# EAGLE design miniosc (EAGLE 7.5.0)
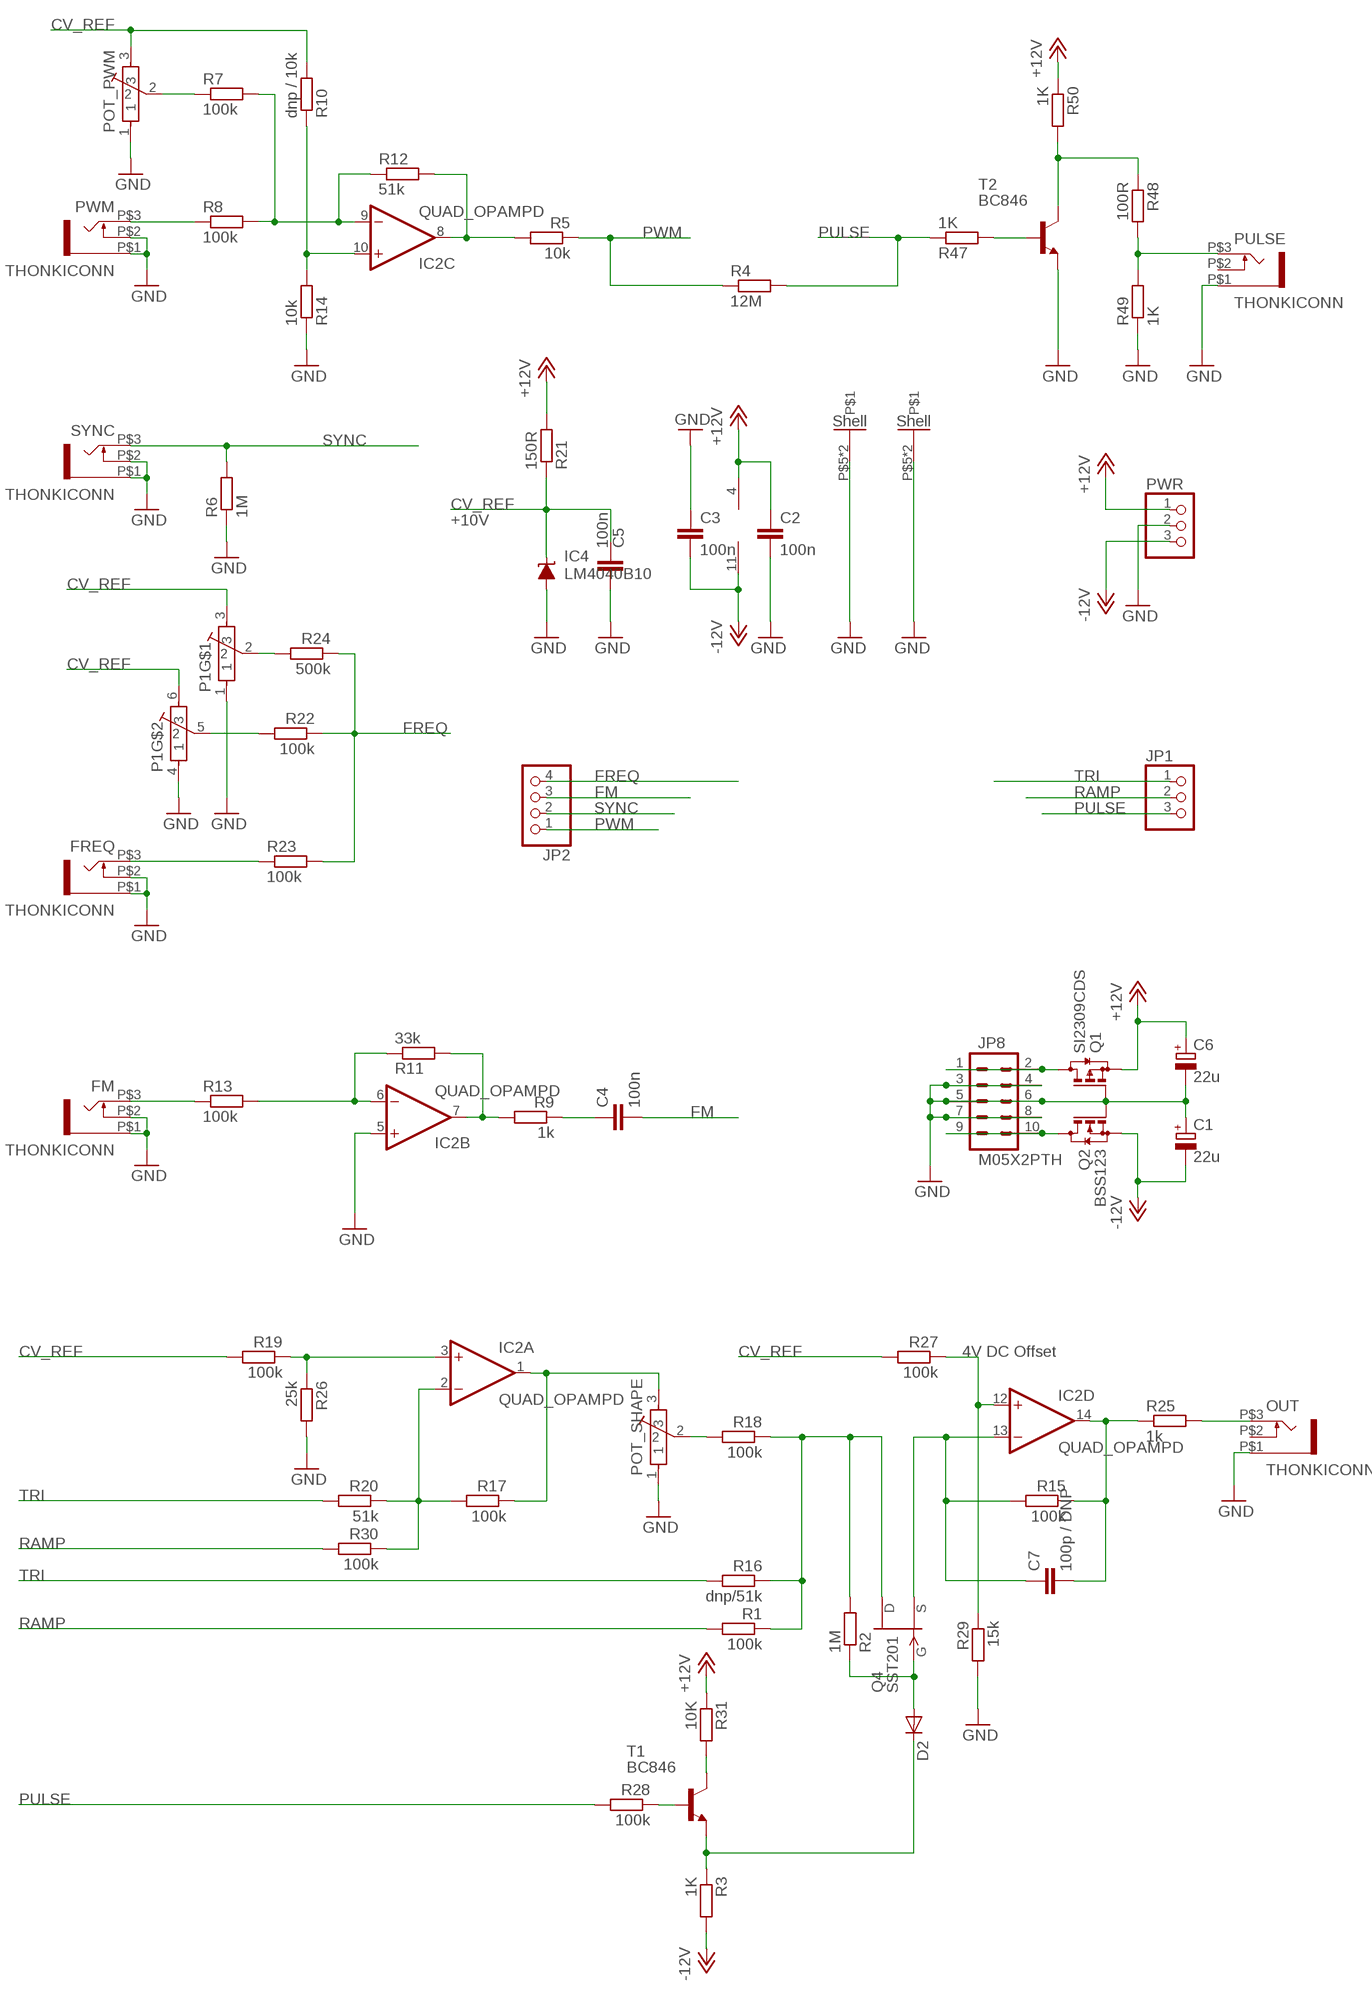
[diagram p0: schematic, sheet 1]

## Parts
C1  22u  CPOL-EU153CLV-0505  [CPOL-5]
C2  100n  C-EUC0603  [C0603]
C3  100n  C-EUC0603  [C0603]
C4  100n  C-EUC0603  [C0603]
C5  100n  C-EUC0603  [C0603]
C6  22u  CPOL-EU153CLV-0505  [CPOL-5]
C7  100p / DNP  C-EUC0603  [C0603]
D2  DIODE  [DIODE-0805]
FM  THONKICONN  [THONKICONN]
FREQ  THONKICONN  [THONKICONN]
IC2  QUAD_OPAMPD  [SO14]
IC4  LM4040B10  LM4041C12DBZ  [DBZ_R-PDSO-G3]
JP1  PINHD-1X3  [1X03]
JP2  PINHD-1X4  [1X04]
JP8  M05X2PTH  [AVR_ICSP]
OUT  THONKICONN  [THONKICONN]
P1  POT-BOURNS-PTD902  [POT-BOURNS-PTD902]
POT_PWM  POT-ALPS-RK09L1140  [POT-ALPS-RK09L1140]
POT_SHAPE  POT-ALPS-RK09L1140  [POT-ALPS-RK09L1140]
PULSE  THONKICONN  [THONKICONN]
PWM  THONKICONN  [THONKICONN]
PWR  PINHD-1X3  [1X03]
Q1  SI2309CDS  BSS84  [SOT23]
Q2  BSS123  [SOT23]
Q4  SST201  [SOT23]
R1  100k  R-EU_0603  [0603]
R2  1M  R-EU_0603  [0603]
R3  1K  R-EU_0603  [0603]
R4  12M  R-EU_0603  [0603]
R5  10k  R-EU_0603  [0603]
R6  1M  R-EU_0603  [0603]
R7  100k  R-EU_0603  [0603]
R8  100k  R-EU_0603  [0603]
R9  1k  R-EU_0603  [0603]
R10  dnp / 10k  R-EU_0603  [0603]
R11  33k  R-EU_0603  [0603]
R12  51k  R-EU_0603  [0603]
R13  100k  R-EU_0603  [0603]
R14  10k  R-EU_0603  [0603]
R15  100k  R-EU_0603  [0603]
R16  dnp/51k  R-EU_0603  [0603]
R17  100k  R-EU_0603  [0603]
R18  100k  R-EU_0603  [0603]
R19  100k  R-EU_0603  [0603]
R20  51k  R-EU_0603  [0603]
R21  150R  R-EU_0603  [0603]
R22  100k  R-EU_0603  [0603]
R23  100k  R-EU_0603  [0603]
R24  500k  R-EU_0603  [0603]
R25  1k  R-EU_0603  [0603]
R26  25k  R-EU_0603  [0603]
R27  100k  R-EU_0603  [0603]
R28  100k  R-EU_0603  [0603]
R29  15k  R-EU_0603  [0603]
R30  100k  R-EU_0603  [0603]
R31  10K  R-EU_0603  [0603]
R47  1K  R-EU_0603  [0603]
R48  100R  R-EU_0603  [0603]
R49  1K  R-EU_0603  [0603]
R50  1K  R-EU_0603  [0603]
SYNC  THONKICONN  [THONKICONN]
T1  BC846  [SOT23]
T2  BC846  [SOT23]

## Nets
+12V: C2.1 C6.+ IC2.4(P:V+) PWR.1 Q1.2(S) R21.2 R31.1 R50.1
-12V: C1.- C3.2 IC2.11(P:V-) PWR.3 Q2.2(S) R3.2
CV_REF: C5.1 IC4.1(C) P1.3 P1.6 POT_PWM.3 R10.2 R19.2 R21.1 R27.2
FM: C4.2 JP2.3
FREQ: JP2.4 R22.1 R23.2 R24.1
GND: C1.+ C2.2 C3.1 C5.2 C6.- FM.P$1 FM.P$2 FREQ.P$1 FREQ.P$2 IC2.5(B:+IN) IC4.2(A) JP8.3 JP8.4 JP8.5 JP8.6 JP8.7 JP8.8 OUT.P$1 P1.1 P1.4 POT_PWM.1 POT_PWM.P$5 POT_PWM.P$6 POT_SHAPE.1 POT_SHAPE.P$5 POT_SHAPE.P$6 PULSE.P$1 PWM.P$1 PWM.P$2 PWR.2 Q1.1(G) Q2.1(G) R6.1 R14.1 R26.2 R29.2 R49.1 SYNC.P$1 SYNC.P$2 T2.2(E)
N$1: R31.2 T1.3(C)
N$2: PWM.P$3 R8.1
N$3: FREQ.P$3 R23.1
N$4: C7.1 IC2.13(D:-IN) Q4.2(S) R15.2
N$6: IC2.9(C:-IN) R7.2 R8.2 R12.1
N$7: IC2.10(C:+IN) R10.1 R14.2
N$8: JP8.9 JP8.10 Q2.3(D)
N$9: P1.2 R24.2
N$10: PULSE.P$3 R48.2 R49.2
N$11: IC2.1(A:OUT) POT_SHAPE.3 R17.1
N$12: JP8.1 JP8.2 Q1.3(D)
N$14: P1.5 R22.2
N$15: IC2.2(A:-IN) R17.2 R20.1 R30.1
N$16: C7.2 IC2.14(D:OUT) R15.1 R25.1
N$17: IC2.3(A:+IN) R19.1 R26.1
N$18: IC2.12(D:+IN) R27.1 R29.1
N$19: FM.P$3 R13.1
N$20: IC2.6(B:-IN) R11.1 R13.2
N$21: OUT.P$3 R25.2
N$22: IC2.7(B:OUT) R9.2 R11.2
N$23: C4.1 R9.1
N$25: Q4.1(D) R1.1 R2.2 R16.1 R18.1
N$26: D2.C R3.1 T1.2(E)
N$27: POT_PWM.2 R7.1
N$28: IC2.8(C:OUT) R5.2 R12.2
N$29: R28.1 T1.1(B)
N$30: POT_SHAPE.2 R18.2
N$32: D2.A Q4.3(G) R2.1
N$62: R47.2 T2.1(B)
N$63: R48.1 R50.2 T2.3(C)
PULSE: JP1.3 R4.2 R28.2 R47.1
PWM: JP2.1 R4.1 R5.1
RAMP: JP1.2 R1.2 R30.2
SYNC: JP2.2 R6.2 SYNC.P$3
TRI: JP1.1 R16.2 R20.2
Unconnected: OUT.P$2 PULSE.P$2

## Notes on the sheet
- +10V
- 4V DC Offset

## Library data of the parts
C1 C6 = Rebel:CPOL-EU: POLARIZED CAPACITOR, European symbol
C2-C5 C7 = Rebel:C-EU: CAPACITOR, European symbol
D2 = Rebel:DIODE: Diode These are standard reverse protection diodes and small signal diodes. SMA package can handle up to about 1A. SOD-323 can handle about 200mA. Watch the SOD-323 package when ordering, there are some mfgs out there that are 5-pin packages.
FM FREQ OUT PULSE PWM SYNC = Rebel:THONKICONN
IC2 = adafruit:QUAD_OPAMP: OP AMP Standard quad package
IC4 = texas:LM4041: PRECISION MICROPOWER SHUNT VOLTAGE REFERENCE Source: http://focus.ti.com/lit/ds/slcs146e/slcs146e.pdf; MF: TEXAS INSTRUMENT CONNECTORS; MPN: LM4041C12QDBZT; OC_FARNELL: 1771733; OC_NEWARK: 43K3376
JP1 PWR = pinhead:PINHD-1X3: PIN HEADER
JP2 = pinhead:PINHD-1X4: PIN HEADER
JP8 = SparkFun:M05X2: Header 5x2 Standard 10-pin dual row 0.1" header. Commonly used with AVR-ISP. Use with Spark Fun Electronics SKU: PRT-00778
P1 = Rebel:POT-BOURNS-PTD902
POT_PWM POT_SHAPE = Rebel:POT-ALPS-RK09L
Q1 = transistor-small-signal:BSS84: P-CHANNEL MOS FET; OC_FARNELL: 1779264
Q2 = transistor-small-signal:BSS123: N-CHANNEL MOS FET; OC_FARNELL: 1843725
Q4 = transistor-fet:?20*: TEMIC / Siliconix N-Channel JFET Source: JFET-J201_Siliconix_data.pdf
R1-R31 R47-R50 = Rebel:R-EU_: RESISTOR, European symbol
T1 T2 = transistor:BC846: NPN TRANSISTOR

## Module VCO
Ports: FREQ_IN(io) FM_IN(io) SYNC_IN(io) PWM_IN(io) TRI_OUT(io) RAMP_OUT(io) PULSE_OUT(io) -12V(pwr) +12V(pwr) GND(pwr)
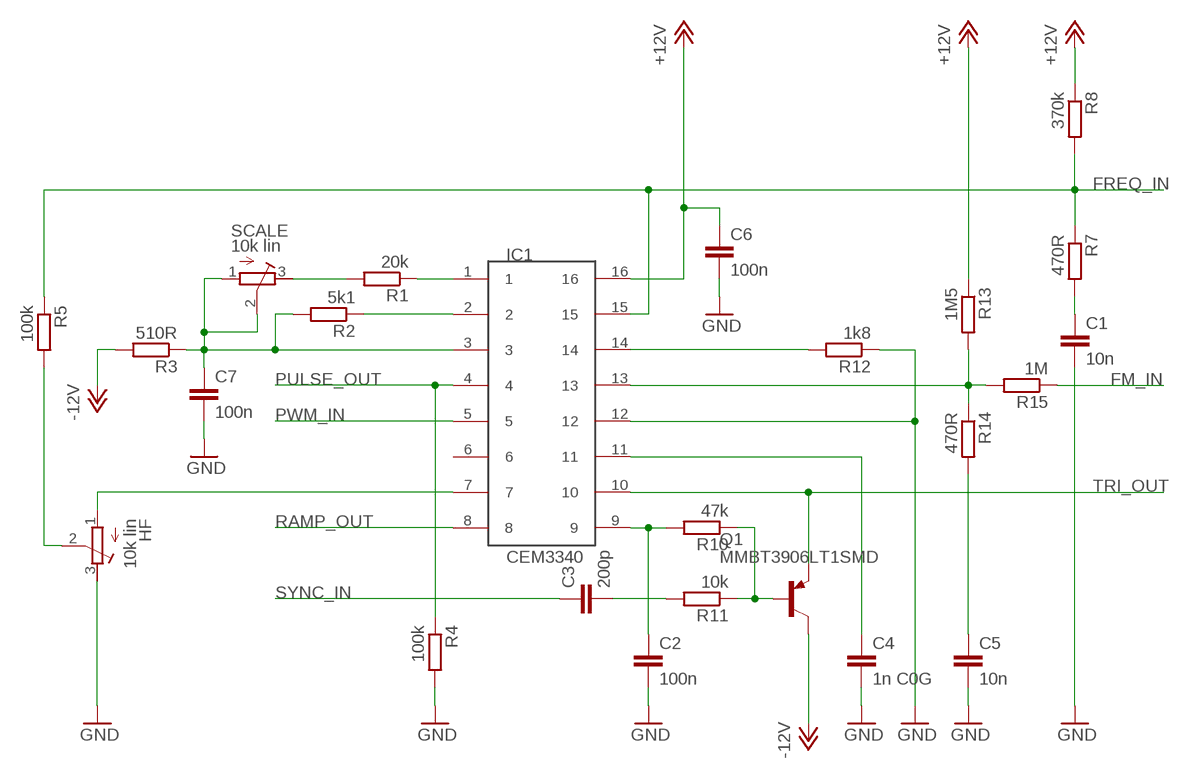
[diagram p1: schematic, module VCO, sheet 1]

### Parts
C1  10n  C-EUC0603  [C0603]
C2  100n  C-EUC0603  [C0603]
C3  200p  C-EUC0603  [C0603]
C4  1n C0G  C-EUC0603  [C0603]
C5  10n  C-EUC0603  [C0603]
C6  100n  C-EUC0603  [C0603]
C7  100n  C-EUC0603  [C0603]
HF  10k lin  R-TRIMM64W  [RTRIM64W]
IC1  CEM3340  [SOIC16N]
Q1  MMBT3906LT1SMD  [SOT23-BEC]
R1  20k  R-EU_0603  [0603]
R2  5k1  R-EU_0603  [0603]
R3  510R  R-EU_0603  [0603]
R4  100k  R-EU_0603  [0603]
R5  100k  R-EU_0603  [0603]
R7  470R  R-EU_0603  [0603]
R8  370k  R-EU_0603  [0603]
R10  47k  R-EU_0603  [0603]
R11  10k  R-EU_0603  [0603]
R12  1k8  R-EU_0603  [0603]
R13  1M5  R-EU_0603  [0603]
R14  470R  R-EU_0603  [0603]
R15  1M  R-EU_0603  [0603]
SCALE  10k lin  R-TRIMM64W  [RTRIM64W]

### Nets
+12V: C6.1 IC1.16 R8.1 R13.1
-12V: Q1.C R3.2
FM_IN: R15.1
FREQ_IN: IC1.15 R5.1 R7.1 R8.2
GND: C1.2 C2.2 C4.2 C5.2 C6.2 C7.2 HF.3(E) IC1.12 R4.2 R12.1
N$1: IC1.1 R1.1
N$2: R1.2 SCALE.3(E)
N$3: HF.1(A) IC1.7
N$4: IC1.2 R2.1
N$5: C7.1 IC1.3 R2.2 R3.1 SCALE.1(A) SCALE.2(S)
N$6: HF.2(S) R5.2
N$9: C1.1 R7.2
N$11: C2.1 IC1.9 R10.2
N$12: Q1.B R10.1 R11.1
N$13: C3.2 R11.2
N$14: C4.1 IC1.11
N$16: IC1.14 R12.2
N$17: IC1.13 R13.2 R14.1 R15.2
N$18: C5.1 R14.2
PULSE_OUT: IC1.4 R4.1
PWM_IN: IC1.5
RAMP_OUT: IC1.8
SYNC_IN: C3.1
TRI_OUT: IC1.10 Q1.E
Unconnected: IC1.6

### Library data of the parts
C1-C7 = Rebel:C-EU: CAPACITOR, European symbol
HF SCALE = resistor:R-TRIMM: Trimm resistor
IC1 = Rebel:CEM3340: CEM3340 VCO
Q1 = transistor-pnp:MMBT3906*: PNP Transistror
R1-R5 R7 R8 R10-R15 = Rebel:R-EU_: RESISTOR, European symbol

## Board
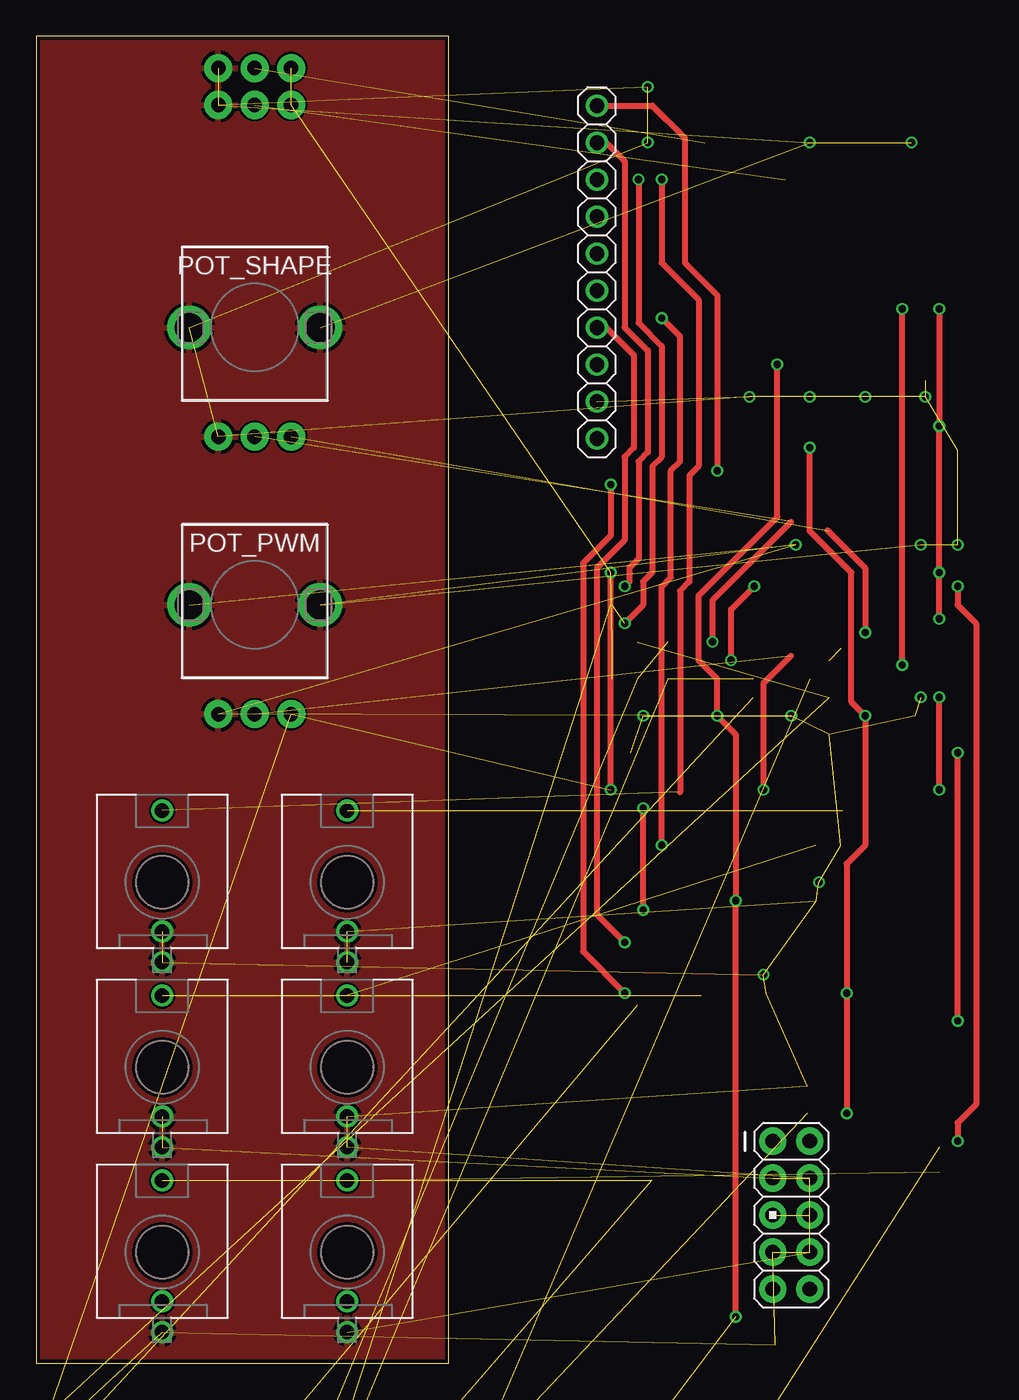
[diagram p2: board, top side]
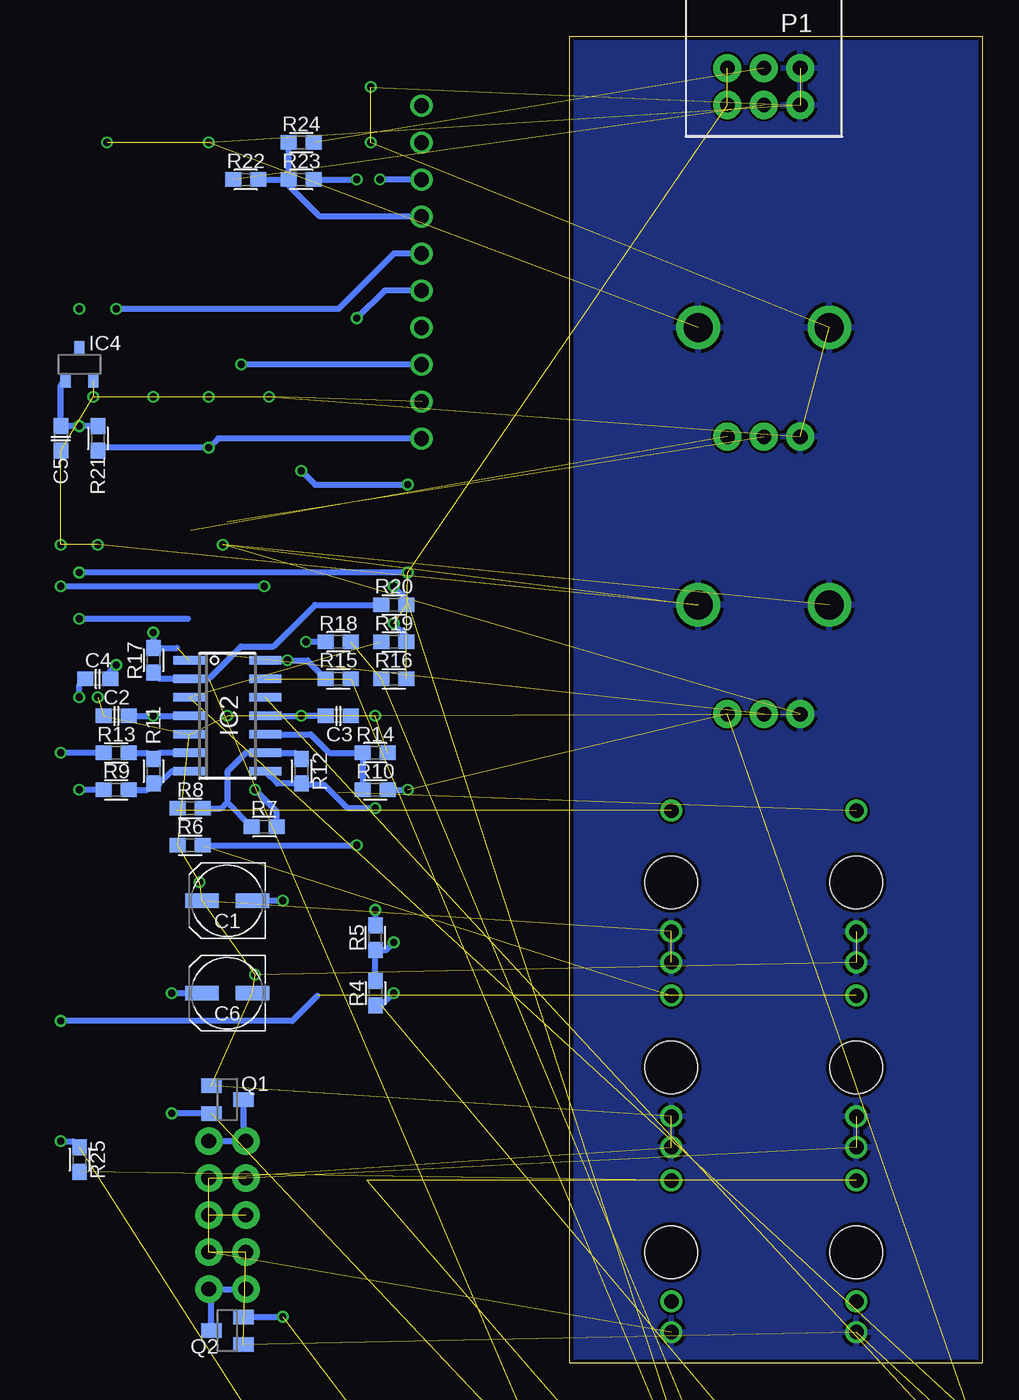
[diagram p3: board, bottom side, seen from below]

Size 28.3 x 91.11 mm. Coordinates in mm from the lower left corner, seen from the top.
Outline: 0,0 28.3,0 28.3,91.11 0,91.11 0,0
Copper layers (1*16): Top 0.035mm / dielectric 1.5mm / Bottom 0.035mm
Design rules "SeeedStudio_2layer_DRU_no_angle_20140221": minimum track width 6mil, minimum drill 12mil, track to track 6mil, track to pad 6mil, pad to pad 6mil, via to via 6mil, smd to smd 0mil, copper to edge 10mil, drill to drill 10mil, minimum pad ring 10mil, minimum via ring 6mil, stop-mask expansion 2mil, vias tented up to drill 100mil, thermal gap 10mil

### Footprints (pad centres in the part's own frame; a part is rotated, then mirrored left to right if it is on the bottom)
CPOL-5 = smd 2.3 x 1: + 1.725,0; - -1.725,0
C0603 = smd 1.1 x 1: 1 -0.85,0; 2 0.85,0
DIODE-0805 = smd 1.1 x 1.4: A -1,0; C 1,0
THONKICONN = drill 1: P$1 0,-5.5; P$2 0,-3.38; P$3 0,4.92 | hole 3.6: 0,0
SO14 = smd 0.6 x 2.2: 1 -3.81,-2.6; 2 -2.54,-2.6; 3 -1.27,-2.6; 4 0,-2.6; 5 1.27,-2.6; 6 2.54,-2.6; 7 3.81,-2.6; 8 3.81,2.6; 9 2.54,2.6; 10 1.27,2.6; 11 0,2.6; 12 -1.27,2.6; 13 -2.54,2.6; 14 -3.81,2.6
DBZ_R-PDSO-G3 = smd 0.7 x 1: 1 -0.95,-1.1; 2 0.95,-1.1; 3 0,1.1
1X03 = drill 1.016: 1 -2.54,0; 2 0,0; 3 2.54,0
1X04 = drill 1.016: 1 -3.81,0; 2 -1.27,0; 3 1.27,0; 4 3.81,0
AVR_ICSP = drill 1.016 pad 1.88: 1 -1.27,5.08; 2 1.27,5.08; 3 -1.27,2.54; 4 1.27,2.54; 5 -1.27,0; 6 1.27,0; 7 -1.27,-2.54; 8 1.27,-2.54; 9 -1.27,-5.08; 10 1.27,-5.08
POT-BOURNS-PTD902 = drill 1 pad 1.93: 1 -2.5,-0.036; 2 0,-0.036; 3 2.5,-0.036; 4 -2.5,2.5; 5 0,2.5; 6 2.5,2.5
POT-ALPS-RK09L1140 = drill 1 pad 1.93: 1 -2.5,-7.5; 2 0,-7.5; 3 2.5,-7.5 | drill 2: P$5 -4.5,0; P$6 4.5,0
SOT23 = smd 1 x 1.4: 1 -0.95,-1.1; 2 0.95,-1.1; 3 0,1.1
0603 = smd 1.1 x 1: 1 -0.85,0; 2 0.85,0

### Placement (x,y rotation side)
C1  51.82,31.75 180 bottom  (outside the outline)
C2  59.44,44.45 180 bottom  (outside the outline)
C3  44.2,44.45 180 bottom  (outside the outline)
C4  60.71,46.99 0 bottom  (outside the outline)
C5  63.25,63.5 270 bottom  (outside the outline)
C6  51.82,25.4 180 bottom  (outside the outline)
C7  -11.68,-99.06 0 top  (outside the outline)
D2  -11.68,-87.63 0 top  (outside the outline)
FM  8.64,20.32 0 top
FREQ  8.64,33.02 0 top
IC2  51.82,44.45 270 bottom  (outside the outline)
IC4  61.98,68.58 0 bottom  (outside the outline)
JP1  38.48,83.82 90 top  (outside the outline)
JP2  38.48,74.93 90 top  (outside the outline)
JP8  51.82,10.16 0 top  (outside the outline)
OUT  21.34,7.62 0 top
P1  14.99,88.9 180 bottom
POT_PWM  14.99,52.07 0 top
POT_SHAPE  14.99,71.12 0 top
PULSE  8.64,7.62 0 top
PWM  21.34,33.02 0 top
PWR  38.48,66.04 90 top  (outside the outline)
Q1  51.82,18.1 270 bottom  (outside the outline)
Q2  51.82,2.22 90 bottom  (outside the outline)
Q4  -11.68,-81.28 0 top  (outside the outline)
R1  -11.68,-102.87 0 top  (outside the outline)
R2  -11.68,-95.25 0 top  (outside the outline)
R3  -12.95,-76.2 0 top  (outside the outline)
R4  41.66,25.4 270 bottom  (outside the outline)
R5  41.66,29.21 90 bottom  (outside the outline)
R6  54.36,35.56 0 bottom  (outside the outline)
R7  49.28,36.83 180 bottom  (outside the outline)
R8  54.36,38.1 0 bottom  (outside the outline)
R9  59.44,39.37 0 bottom  (outside the outline)
R10  41.66,39.37 0 bottom  (outside the outline)
R11  56.9,40.64 270 bottom  (outside the outline)
R12  46.74,40.64 270 bottom  (outside the outline)
R13  59.44,41.91 0 bottom  (outside the outline)
R14  41.66,41.91 180 bottom  (outside the outline)
R15  44.2,46.99 0 bottom  (outside the outline)
R16  40.39,46.99 0 bottom  (outside the outline)
R17  56.9,48.26 270 bottom  (outside the outline)
R18  44.2,49.53 180 bottom  (outside the outline)
R19  40.39,49.53 0 bottom  (outside the outline)
R20  40.39,52.07 0 bottom  (outside the outline)
R21  60.71,63.5 270 bottom  (outside the outline)
R22  50.55,81.28 180 bottom  (outside the outline)
R23  46.74,81.28 180 bottom  (outside the outline)
R24  46.74,83.82 0 bottom  (outside the outline)
R25  61.98,13.97 270 bottom  (outside the outline)
R26  -2.79,-7.62 0 top  (outside the outline)
R27  -2.79,-11.43 0 top  (outside the outline)
R28  -2.79,-26.67 0 top  (outside the outline)
R29  -2.79,-30.48 0 top  (outside the outline)
R30  -11.68,-106.68 0 top  (outside the outline)
R31  -11.68,-110.49 0 top  (outside the outline)
R47  -12.95,-45.72 0 top  (outside the outline)
R48  -9.14,-45.72 0 top  (outside the outline)
R49  -12.95,-49.53 0 top  (outside the outline)
R50  -9.14,-49.53 0 top  (outside the outline)
SYNC  21.34,20.32 0 top
T1  -11.68,-66.04 0 top  (outside the outline)
T2  -11.68,-39.37 0 top  (outside the outline)

### Tracks (layer width: path | path; a pad name or v marks a point on that pad's centre or on a via)
+12V  (via drill 0.5)  (2 unrouted)
  Top 0.406: v55.63,17.14 v55.63,25.4 55.63,34.29 56.9,35.56 v56.9,44.45 55.94,45.4 55.94,54.29 53.09,57.15 v53.09,62.87
  Bottom 0.406: IC2.4 v56.9,44.45 C2.1 | Q1.2 v55.62,17.15 v55.63,17.14 | C6.+ v55.63,25.4 | R21.2 60.49,62.87 v53.09,62.87 52.45,63.5 PWR.1
-12V  (via drill 0.5)  (1 unrouted)
  Top 0.406: v48.01,3.17 v48.01,31.75 48.01,43.18 v46.74,44.45 46.74,46.99 45.47,48.26 45.47,52.7 50.86,58.1 v50.86,68.58
  Bottom 0.406: IC2.11 v46.74,44.45 C3.2 | Q2.2 49.28,3.17 v48.01,3.17 | PWR.3 v50.86,68.58 | v48.01,31.75 C1.-
CV_REF  (via drill 0.5)  (5 unrouted)
  Top 0.406: v61.98,51.12 v61.98,54.29 v61.98,64.35 v61.98,72.39 | v39.43,39.37 v39.43,54.29
  Bottom 0.406: IC4.1 63.25,67.16 C5.1 v61.98,64.35 R21.1 | v61.98,51.12 54.51,51.12 | R10.2 v39.43,39.37 | v39.43,54.29 v61.98,54.29
FM  (via drill 0.5)
  Top 0.406: v59.44,47.94 v59.44,72.39
  Bottom 0.406: C4.2 59.86,47.52 v59.44,47.94 | JP2.3 40.39,76.2 44.2,72.39 v59.44,72.39
FREQ
  Bottom 0.406: R22.1 R23.2 | JP2.4 45.47,78.74 47.59,80.86 R23.2 | R23.2 R24.1
GND  (via drill 0.5)  (55 unrouted)
  other vias: 41.97,83.82 41.97,87.63 53.09,83.82 51.82,44.45 60.71,45.72 41.66,44.45 53.72,33.02 49.91,26.67 52.13,56.2 60.71,56.2 63.25,56.2 48.96,66.36 53.09,66.36 56.9,66.36 61.02,66.36 60.07,83.82
  pour Bottom: -4.06,102.87 -4.06,-3.81 31.5,-3.81 31.5,102.87
  pour Top: -5.33,102.87 -5.33,-3.81 32.77,-3.81 32.77,102.87
N$1  (1 unrouted)
N$2  (1 unrouted)
  Bottom 0.406: 55.37,37.94 R8.1
N$3  (via drill 0.5)  (1 unrouted)
  Top 0.406: v42.93,81.28 42.93,75.56 45.47,73.03 45.47,61.59 44.83,60.96 44.83,53.66 44.2,53.02 44.2,39.21
  Bottom 0.406: R23.1 v42.93,81.28
N$4  (3 unrouted)
N$6
  Bottom 0.406: R12.1 47.16,41.91 IC2.9 50.55,41.91 51.82,40.64 51.82,38.52 | 51.82,38.52 R7.2 | R8.2 52.24,38.1 51.82,38.52
N$7
  Bottom 0.406: IC2.10 46.1,43.18 44.83,41.91 R14.2 R10.1
N$8
  Bottom 0.406: Q2.3 52.92,4.91 JP8.10 JP8.9
N$9  (1 unrouted)
N$10  (3 unrouted)
N$11  (via drill 0.5)  (2 unrouted)
  Top 0.406: 54.32,57.19 56.9,54.61 v56.9,50.16
  Bottom 0.406: 55.27,49.11 R17.1 v56.9,50.16
N$12
  Bottom 0.406: JP8.2 JP8.1 50.72,15.41 Q1.3
N$14  (1 unrouted)
N$15  (1 unrouted)
  Bottom 0.406: R17.2 56.48,46.99 IC2.2 53.09,46.99 50.86,49.21 48.64,49.21 45.78,52.07 R20.1
N$16  (via drill 0.5)  (1 unrouted)
  Top 0.406: v47.69,48.26 47.69,51.75 v49.28,53.34 | v63.25,53.34 63.25,52.07 64.52,50.8 64.52,17.78 63.25,16.51 v63.25,15.24
  Bottom 0.406: R15.1 46.32,48.26 v47.69,48.26 IC2.14 | v49.28,53.34 v63.25,53.34 | v63.25,15.24 62.4,15.24 R25.1
N$17  (2 unrouted)
N$18  (2 unrouted)
N$19  (via drill 0.5)  (1 unrouted)
  Top 0.406: v63.25,23.5 v63.25,41.91
  Bottom 0.406: 45.63,25.24 47.37,23.5 v63.25,23.5 | R13.1 v63.25,41.91
N$20
  Bottom 0.406: IC2.6 56.48,41.91 R11.1 57.32,41.91 R13.2
N$21  (1 unrouted)
N$22
  Bottom 0.406: IC2.7 55.63,40.64 56.48,39.79 R11.2 57.32,39.37 R9.2
N$23  (via drill 0.5)
  Top 0.406: v61.98,39.37 v61.98,45.72
  Bottom 0.406: R9.1 v61.98,39.37 | v61.98,45.72 61.98,46.57 C4.1
N$25  (4 unrouted)
N$26  (2 unrouted)
N$27  (via drill 0.5)  (1 unrouted)
  Top 0.406: v49.91,39.37 49.91,46.67 51.82,48.58
  Bottom 0.406: R7.1 48.43,37.88 v49.91,39.37
N$28  (via drill 0.5)
  Top 0.406: v41.66,31.11 v41.66,38.1
  Bottom 0.406: IC2.8 48.37,39.79 R12.2 46.63,39.69 45.15,39.69 43.56,38.1 v41.66,38.1 | v41.66,31.11 R5.2
N$29  (1 unrouted)
N$30  (via drill 0.5)  (1 unrouted)
  Top 0.406: v46.42,49.53 46.42,52.39 51.82,57.78
  Bottom 0.406: R18.2 v46.42,49.53
N$32  (2 unrouted)
N$62  (1 unrouted)
N$63  (2 unrouted)
PULSE  (via drill 0.5)  (2 unrouted)
  Top 0.406: v40.39,25.4 37.53,28.26 37.53,54.93 39.43,56.83 v39.43,60.33 | JP1.3 42.29,86.36 44.51,84.14 44.51,75.56 46.74,73.34 v46.74,61.28
  Bottom 0.406: R4.2 41.24,24.55 v40.39,25.4 | v46.74,61.28 45.78,60.33 v39.43,60.33
PWM  (via drill 0.5)
  Top 0.406: v40.39,28.89 38.48,30.8 38.48,54.61 40.39,56.52 40.39,62.23 41.02,62.87 41.02,69.22 39.12,71.12 JP2.1
  Bottom 0.406: R4.1 R5.1 40.92,28.36 v40.39,28.89
RAMP  (via drill 0.5)  (2 unrouted)
  Top 0.406: JP1.2 39.12,83.82 40.39,82.55 40.39,71.12 41.97,69.53 41.97,62.55 41.34,61.91 41.34,55.24 40.7,54.61 40.7,53.66 v40.39,53.34
  Bottom 0.406: 39.54,52.49 v40.39,53.34
SYNC  (via drill 0.5)  (1 unrouted)
  Top 0.406: v42.93,35.56 42.93,53.34 43.56,53.98 43.56,61.28 44.2,61.91 44.2,70.48 v42.93,71.75
  Bottom 0.406: R6.2 v42.93,35.56 | JP2.2 41.02,73.66 v42.93,71.75
TRI  (via drill 0.5)  (2 unrouted)
  Top 0.406: v41.34,81.28 41.34,71.44 42.93,69.85 42.93,62.23 42.29,61.59 42.29,54.29 41.66,53.66 41.66,52.07 v40.39,50.8
  Bottom 0.406: JP1.1 v41.34,81.28 | 39.54,49.95 v40.39,50.8